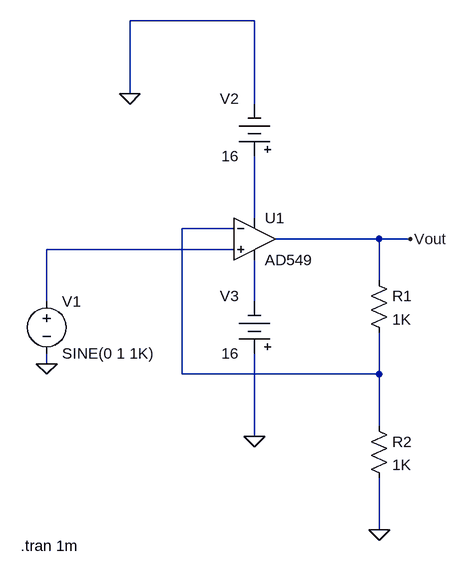
[diagram p0: schematic Draft2.asc]
Draft2.asc, the LTspice schematic file:
Version 4.1
SHEET 1 880 680
WIRE 368 -240 176 -240
WIRE 176 -128 176 -240
WIRE 368 -112 368 -240
WIRE 368 64 368 -32
WIRE 336 80 256 80
WIRE 560 96 400 96
WIRE 608 96 560 96
WIRE 336 112 48 112
WIRE 560 160 560 96
WIRE 48 192 48 112
WIRE 368 192 368 128
WIRE 48 288 48 272
WIRE 256 304 256 80
WIRE 560 304 560 240
WIRE 560 304 256 304
WIRE 560 384 560 304
WIRE 368 400 368 272
WIRE 560 544 560 464
FLAG 48 288 0
FLAG 608 96 Vout
FLAG 560 544 0
FLAG 368 400 0
FLAG 176 -128 0
SYMBOL voltage 48 176 R0
WINDOW 123 0 0 Left 0
WINDOW 39 0 0 Left 0
SYMATTR InstName V1
SYMATTR Value SINE(0 1 1K)
SYMBOL OpAmps\\AD549 368 32 R0
SYMATTR InstName U1
SYMBOL res 544 144 R0
SYMATTR InstName R1
SYMATTR Value 1K
SYMBOL res 544 368 R0
SYMATTR InstName R2
SYMATTR Value 1K
SYMBOL Misc\\battery 368 -16 R180
WINDOW 0 24 104 Left 2
WINDOW 3 24 16 Left 2
WINDOW 123 0 0 Left 0
WINDOW 39 0 0 Left 0
SYMATTR InstName V2
SYMATTR Value 16
SYMBOL Misc\\battery 368 288 R180
WINDOW 0 24 104 Left 2
WINDOW 3 24 16 Left 2
WINDOW 123 0 0 Left 0
WINDOW 39 0 0 Left 0
SYMATTR InstName V3
SYMATTR Value 16
TEXT 8 568 Left 2 !.tran 1m

The netlist it stands for:
* Draft2.asc
V1 N003 0 SINE(0 1 1K)
X§U1 N003 N002 N001 N004 Vout AD549  ; pins In+ In- V+ V- OUT
R1 Vout N002 1K
R2 N002 0 1K
V2 N001 0 16
V3 0 N004 16
.tran 1m
.backanno
.end